# EAGLE design vga-switch (EAGLE 6.0)
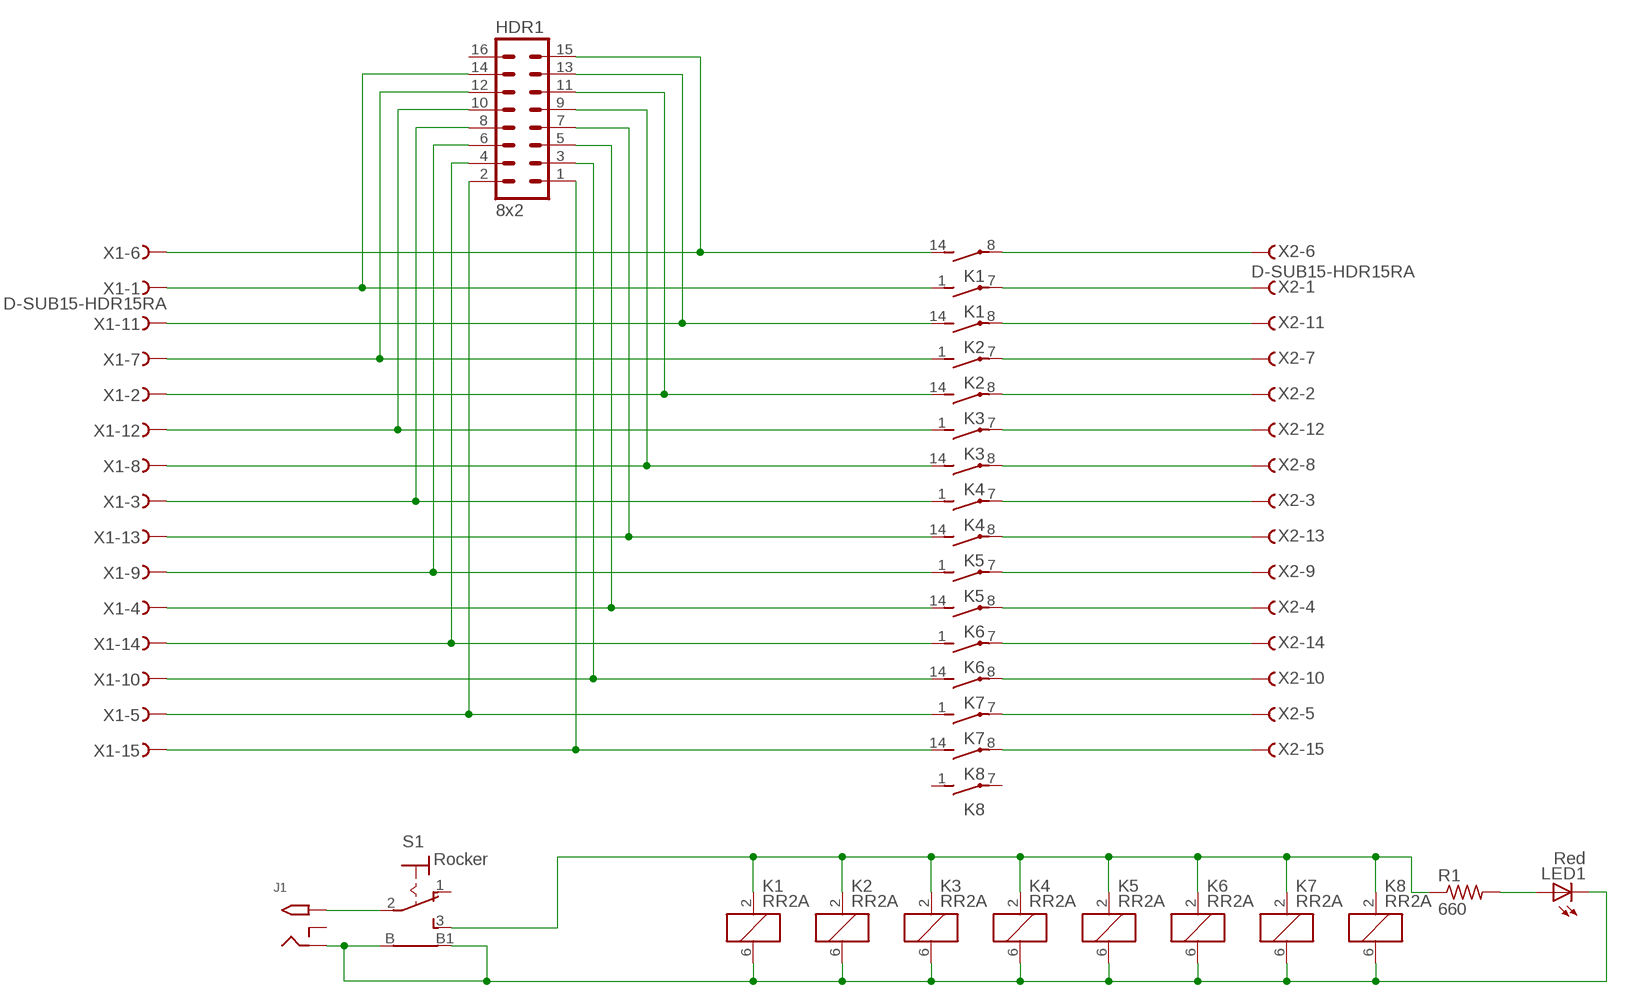
[diagram p0: schematic, sheet 1]

## Parts
HDR1  8x2  MA08-2  [MA08-2]
J1  2.1MMJACKTHM  [PJ-102A]
K1  RR2A  [RR2A]
K2  RR2A  [RR2A]
K3  RR2A  [RR2A]
K4  RR2A  [RR2A]
K5  RR2A  [RR2A]
K6  RR2A  [RR2A]
K7  RR2A  [RR2A]
K8  RR2A  [RR2A]
LED1  Red  LED5MM  [LED5MM]
R1  660  R-US_0207/10  [0207/10]
S1  Rocker  ROCKERSWITCH  [ROCKERSWITCH]
X1  D-SUB15-HDR15RA  [HDR15RA]
X2  D-SUB15-HDR15RA  [HDR15RA]

## Nets
N$1: J1.TIP S1.2(P)
N$2: J1.RING K1.6 K2.6 K3.6 K4.6 K5.6 K6.6 K7.6 K8.6 LED1.K(C) S1.B S1.B1
N$3: HDR1.15 K1.14(3:S) X1.6
N$4: K1.2 K2.2 K3.2 K4.2 K5.2 K6.2 K7.2 K8.2 R1.1 S1.3(S)
N$5: LED1.A R1.2
N$6: HDR1.14 K1.1(2:S) X1.1
N$7: HDR1.13 K2.14(3:S) X1.11
N$8: HDR1.12 K2.1(2:S) X1.7
N$9: HDR1.11 K3.14(3:S) X1.2
N$10: HDR1.10 K3.1(2:S) X1.12
N$11: HDR1.9 K4.14(3:S) X1.8
N$12: HDR1.8 K4.1(2:S) X1.3
N$13: HDR1.7 K5.14(3:S) X1.13
N$14: HDR1.6 K5.1(2:S) X1.9
N$15: HDR1.5 K6.14(3:S) X1.4
N$16: HDR1.4 K6.1(2:S) X1.14
N$17: HDR1.3 K7.14(3:S) X1.10
N$18: HDR1.2 K7.1(2:S) X1.5
N$19: HDR1.1 K8.14(3:S) X1.15
N$33: K1.8(3:P) X2.6
N$34: K1.7(2:P) X2.1
N$35: K2.8(3:P) X2.11
N$36: K2.7(2:P) X2.7
N$37: K3.8(3:P) X2.2
N$38: K3.7(2:P) X2.12
N$39: K4.8(3:P) X2.8
N$40: K4.7(2:P) X2.3
N$41: K5.8(3:P) X2.13
N$42: K5.7(2:P) X2.9
N$43: K6.8(3:P) X2.4
N$44: K6.7(2:P) X2.14
N$45: K7.8(3:P) X2.10
N$46: K7.7(2:P) X2.5
N$47: K8.8(3:P) X2.15
Unconnected: HDR1.16 J1.RING_SW K8.1(2:S) K8.7(2:P) S1.1(O)

## Library data of the parts
HDR1 = con-lstb:MA08-2: PIN HEADER; OC_FARNELL: unknown; OC_NEWARK: unknown
J1 = adafruit:2.1MMJACK: 2.1mm x 5.5mm THM DC jack with internal switch. Digikey part #PJ-102A, 4UCON part #05537 2.1mm x 5.5mm SMT DC jack with internal switch. Digikey part #PJ-002A-SMT, 4UCON part #03267 By microbuilder.eu & adafruit.com
K1-K8 = relay:RR2A: RELAY reed, polarity, 2 x norm. open; OC_FARNELL: unknown; OC_NEWARK: unknown
LED1 = led:LED: LED OSRAM: - CHIPLED LG R971, LG N971, LY N971, LG Q971, LY Q971, LO R971, LY R971 LH N974, LH R974 LS Q976, LO Q976, LY Q976 LO Q996 - Hyper CHIPLED LW Q18S LB Q993, LB Q99A, LB R99A - SideLED LS A670, LO A670, LY A670, LG A670, LP A670 LB A673, LV A673, LT A673, LW A673 LH A674 LY A675 LS A676, LA A676, LO A676, LY A676, LW A676 LS A679, LY A679, LG A679 - Hyper Micro SIDELED® LS Y876, LA Y876, LO Y876, LY Y876 LT Y87S - SmartLED LW L88C, LW L88S LB L89C, LB L89S, LG L890 LS L89K, LO L89K, LY L89K LS L896, LA L896, LO L896, LY L896 - TOPLED LS T670, LO T670, LY T670, LG T670, LP T670 LSG T670, LSP T670, LSY T670, LOP T670, LYG T670 LG T671, LOG T671, LSG T671 LB T673, LV T673, LT T673, LW T673 LH T674 LS T676, LA T676, LO T676, LY T676, LB T676, LH T676, LSB T676, LW T676 LB T67C, LV T67C, LT T67C, LS T67K, LO T67K, LY T67K, LW E67C LS E67B, LA E67B, LO E67B, LY E67B, LB E67C, LV E67C, LT E67C LW T67C LS T679, LY T679, LG T679 LS T770, LO T770, LY T770, LG T770, LP T770 LB T773, LV T773, LT T773, LW T773 LH T774 LS E675, LA E675, LY E675, LS T675 LS T776, LA T776, LO T776, LY T776, LB T776 LHGB T686 LT T68C, LB T68C - Hyper Mini TOPLED® LB M676 - Mini TOPLED Santana® LG M470 LS M47K, LO M47K, LY M47K Source: http://www.osram.convergy.de LUXEON: - LUMILED® LXK2-PW12-R00, LXK2-PW12-S00, LXK2-PW14-U00, LXK2-PW14-V00 LXK2-PM12-R00, LXK2-PM12-S00, LXK2-PM14-U00 LXK2-PE12-Q00, LXK2-PE12-R00, LXK2-PE12-S00, LXK2-PE14-T00, LXK2-PE14-U00 LXK2-PB12-K00, LXK2-PB12-L00, LXK2-PB12-M00, LXK2-PB14-N00, LXK2-PB14-P00, LXK2-PB14-Q00 LXK2-PR12-L00, LXK2-PR12-M00, LXK2-PR14-Q00, LXK2-PR14-R00 LXK2-PD12-Q00, LXK2-PD12-R00, LXK2-PD12-S00 LXK2-PH12-R00, LXK2-PH12-S00 LXK2-PL12-P00, LXK2-PL12-Q00, LXK2-PL12-R00 Source: www.luxeon.com KINGBRIGHT: KA-3528ASYC Source: www.kingbright.com
R1 = resistor:R-US_: RESISTOR, American symbol
S1 = antitronics:ROCKERSWITCH: Rocker Switch C&K ET01J6ABE2
X1 X2 = con-thomas-betts:D-SUB15-: D-Subminiatur Connector Source: Electronioc Interconnects European Edition 1998; OC_FARNELL: unknown; OC_NEWARK: unknown

## Board
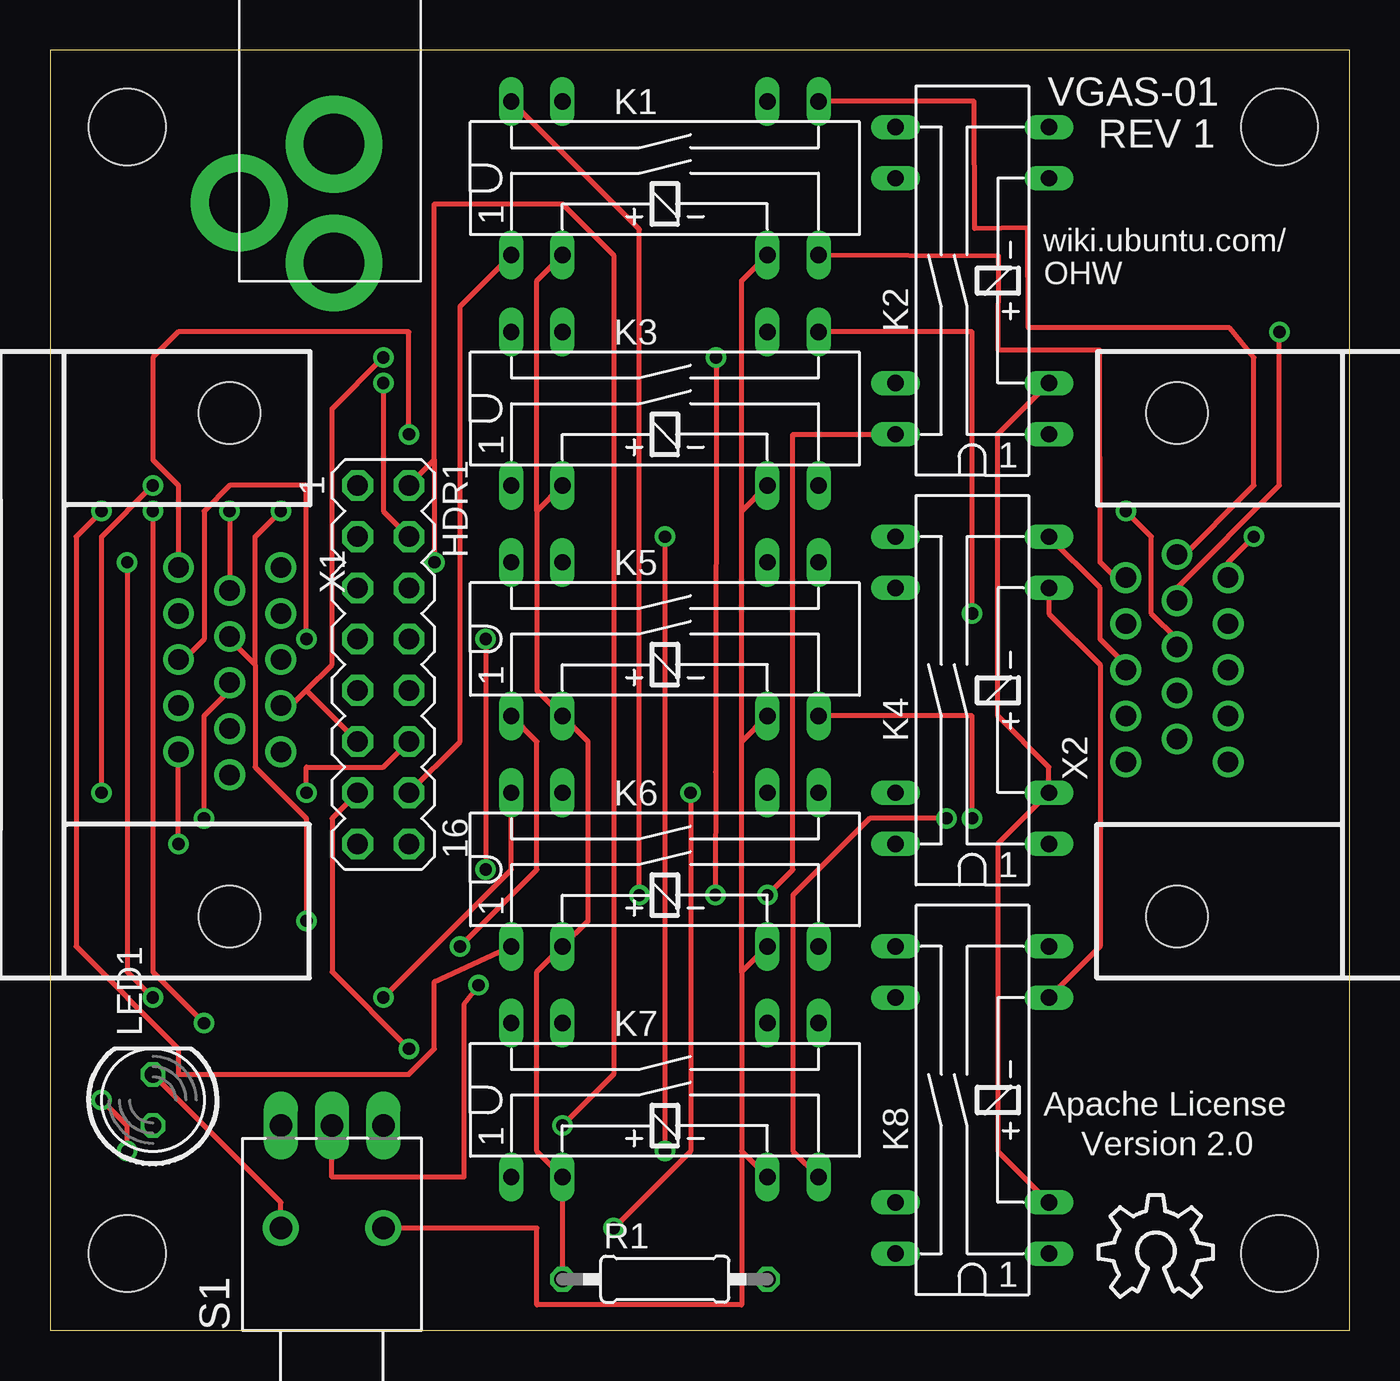
[diagram p1: board, top side]
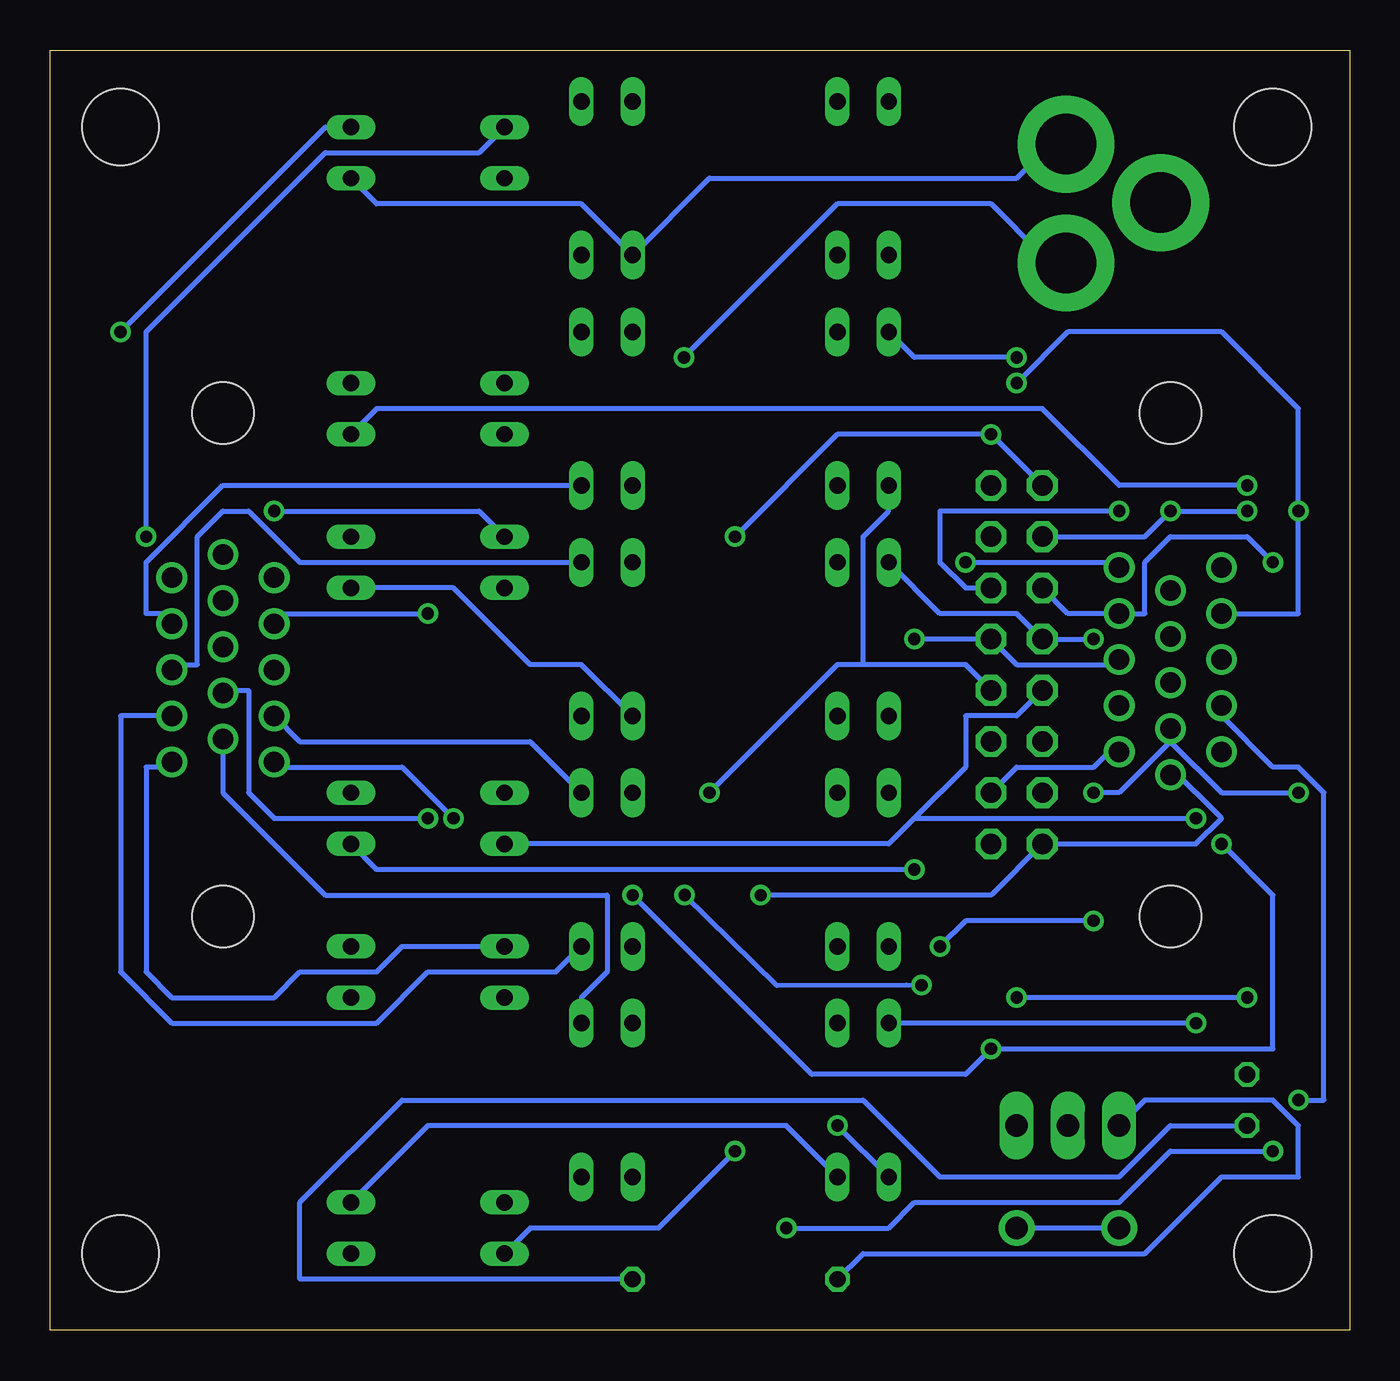
[diagram p2: board, bottom side, seen from below]

Size 64.44 x 63.49 mm. Coordinates in mm from the lower left corner, seen from the top.
Outline: 0,0 64.44,0 64.44,63.49 0,63.49 0,0
Copper layers (1*16): Top 0.0178mm / dielectric 59mil / Bottom 0.0178mm
Design rules: minimum track width 6mil, minimum drill 14mil, track to track 6mil, track to pad 6mil, pad to pad 6mil, via to via 6mil, smd to smd 6mil, copper to edge 20mil, drill to drill 16mil, minimum pad ring 8mil, minimum via ring 8mil, stop-mask expansion 3mil, vias tented up to drill 0mil, thermal gap 10mil
Holes 3.8 mm at 3.81,3.81 3.81,59.69 60.96,59.69 60.96,3.81
tRestrict: area 0,57.2 to 6.3,63.5; area 6.4,43.2 to 11.4,48.3; area 6.4,17.8 to 11.4,22.9; area 0,0 to 6.3,6.3; area 58.4,0 to 64.8,6.3; area 53.3,17.8 to 58.4,22.9; area 53.3,43.2 to 58.4,48.3; area 58.4,57.2 to 64.8,63.5; area 9.5,0 to 18.4,4
bRestrict: area 58.4,57.2 to 64.8,63.5; area 53.3,43.2 to 58.4,48.3; area 53.3,17.8 to 58.4,22.9; area 58.4,0 to 64.8,6.3; area 0,0 to 6.3,6.3; area 6.4,17.8 to 11.4,22.9; area 6.4,43.2 to 11.4,48.3; area 0,57.2 to 6.3,63.5

### Footprints (pad centres in the part's own frame; a part is rotated, then mirrored left to right if it is on the bottom)
MA08-2 = drill 1.016 octagon: 1 -8.89,-1.27; 2 -8.89,1.27; 3 -6.35,-1.27; 4 -6.35,1.27; 5 -3.81,-1.27; 6 -3.81,1.27; 7 -1.27,-1.27; 8 -1.27,1.27; 9 1.27,-1.27; 10 1.27,1.27; 11 3.81,-1.27; 12 3.81,1.27; 13 6.35,-1.27; 14 6.35,1.27; 15 8.89,-1.27; 16 8.89,1.27
PJ-102A = drill 3 pad 4.8: RING 0.1,-3.39; RING_SW -4.6,-6.29; TIP 0.1,-9.29
RR2A = drill 0.813 long: 1 -7.62,-3.81; 2 -5.08,-3.81; 6 5.08,-3.81; 7 7.62,-3.81; 8 7.62,3.81; 9 5.08,3.81; 13 -5.08,3.81; 14 -7.62,3.81
LED5MM = drill 0.813 octagon: A -1.27,0; K 1.27,0
0207/10 = drill 0.813 octagon: 1 -5.08,0; 2 5.08,0
ROCKERSWITCH = drill 1.118 long: 1 5.08,-2.54; 2 5.08,0; 3 5.08,2.54 | drill 1.118 pad 1.778: B 0,-2.54; B1 0,2.54
HDR15RA = drill 1.016: 1 4.318,2.54; 2 2.032,2.54; 3 -0.254,2.54; 4 -2.54,2.54; 5 -4.826,2.54; 6 5.461,0; 7 3.175,0; 8 0.889,0; 9 -1.397,0; 10 -3.683,0; 11 4.318,-2.54; 12 2.032,-2.54; 13 -0.254,-2.54; 14 -2.54,-2.54; 15 -4.826,-2.54 | hole 3.048: -12.497,0; 12.497,0

### Placement (x,y rotation side)
HDR1  16.51,33.02 270 top
J1  13.97,62.23 0 top
K1  30.48,57.15 0 top
K2  45.72,52.07 90 top
K3  30.48,45.72 0 top
K4  45.72,31.75 90 top
K5  30.48,34.29 0 top
K6  30.48,22.86 0 top
K7  30.48,11.43 0 top
K8  45.72,11.43 90 top
LED1  5.08,11.43 90 top
R1  30.48,2.54 0 top
S1  13.97,5.08 90 top
U$1  [OSHW_8X200_NOTEXT]  51.99,1.65 0 top
U$2  [UBUNTU-LOGO]  50.55,12.68 0 top
X1  8.89,33.02 270 top
X2  55.88,33.02 90 top

### Tracks (layer width: path | path; a pad name or v marks a point on that pad's centre or on a via)
N$1  (via drill 0.61)
  Top 0.254: S1.2 13.97,7.6 20.51,7.6 20.51,16.17 v21.23,17.12 | v32.98,21.59 32.99,27.7 v33.02,48.26
  Bottom 0.254: v21.23,17.12 21.98,17.14 28.41,17.11 v32.98,21.59 | v33.02,48.26 25.4,55.88 17.78,55.88 15.24,53.34 J1.TIP
N$2
  Top 0.254: K8.6 52.07,19.05 52.07,33.02 49.53,35.56 K4.6 | LED1.K 11.43,6.35 S1.B1 | 34.29,8.89 K7.6 | 34.29,17.78 34.29,8.89 | K6.6 34.29,17.78 | 34.29,29.21 K5.6 | 34.29,17.78 34.29,29.21 | 34.29,40.64 K3.6 | 34.29,29.21 34.29,40.64 | K1.6 34.29,52.07 34.29,40.64 | S1.B 24.13,5.08 24.13,1.27 34.29,1.27 34.29,8.89
  Bottom 0.254: S1.B1 S1.B | K2.6 48.26,55.88 38.1,55.88 K1.6 31.75,57.15 16.51,57.15 15.24,58.42 J1.RING | K4.6 44.45,36.83 40.64,33.02 38.1,33.02 K5.6
N$3  (via drill 0.61)
  Top 0.254: K1.14 29.21,54.61 v29.21,21.59
  Bottom 0.254: v29.21,21.59 17.78,21.59 HDR1.15 7.62,24.13 6.35,25.4 8.89,27.94 X1.6
N$4
  Top 0.254: K8.2 46.99,8.89 46.99,24.13 K4.2 49.53,27.94 46.99,30.48 46.99,44.45 K2.2 | 24.13,40.64 24.13,31.75 K5.2 26.67,29.21 26.67,20.32 K6.2 24.13,17.78 24.13,8.89 K7.2 R1.1 | K3.2 24.13,40.64 | K1.2 24.13,52.07 24.13,40.64
  Bottom 0.254: S1.3 10.16,11.43 3.81,11.43 2.54,10.16 2.54,7.62 6.35,7.62 10.16,3.81 24.13,3.81 R1.1 | K8.2 45.72,10.16 27.94,10.16 K7.2
N$5
  Bottom 0.254: LED1.A 8.89,10.16 11.43,7.62 20.32,7.62 24.13,11.43 46.99,11.43 52.07,6.35 52.07,2.54 R1.2
N$6
  Top 0.254: K1.1 20.32,50.8 20.32,29.21 HDR1.14
  Bottom 0.254: HDR1.14 16.51,27.94 12.7,27.94 11.43,29.21 X1.1
N$7  (via drill 0.61)
  Top 0.254: K2.14 36.83,44.45 36.83,22.86 v35.56,21.59 | v17.78,13.97 13.97,17.78 13.97,25.4 HDR1.13 | v6.35,24.13 X1.11 6.35,29.21
  Bottom 0.254: v35.56,21.59 26.67,12.7 19.05,12.7 v17.78,13.97 3.81,13.97 3.81,21.59 v6.35,24.13
N$8  (via drill 0.61)
  Top 0.254: v5.08,41.91 2.54,39.37 v2.54,26.67 | HDR1.12 16.51,27.94 12.7,27.94 v12.7,26.67
  Bottom 0.254: K2.1 48.26,45.72 15.24,45.72 11.43,41.91 v5.08,41.91 | v2.54,26.67 6.35,26.67 8.89,29.21 | v12.7,26.67 11.43,26.67 8.89,29.21 | 8.89,29.21 X1.7
N$9  (via drill 0.61)
  Top 0.254: v16.51,48.26 13.97,45.72 13.97,33.02 12.7,31.75 | 12.7,31.75 11.43,30.48 X1.2 | 12.7,31.75 HDR1.11
  Bottom 0.254: K3.14 21.59,48.26 v16.51,48.26
N$10  (via drill 0.61)
  Top 0.254: v2.54,11.43 3.81,10.16 v3.81,8.89 | v27.94,5.08 31.75,8.89 v31.75,26.67
  Bottom 0.254: K3.1 22.86,40.64 24.13,39.37 24.13,33.02 | 24.13,33.02 19.05,33.02 HDR1.10 | v2.54,11.43 1.27,11.43 1.27,26.67 2.54,27.94 3.81,27.94 6.35,30.48 X1.12 | v3.81,8.89 8.89,8.89 11.43,6.35 21.59,6.35 22.86,5.08 v27.94,5.08 | v31.75,26.67 25.4,33.02 24.13,33.02
N$11  (via drill 0.61)
  Top 0.254: v7.62,25.4 7.62,30.48 8.89,31.75 X1.8
  Bottom 0.254: K4.14 22.86,24.13 21.59,25.4 | 21.59,25.4 19.05,27.94 19.05,30.48 16.51,30.48 HDR1.9 | 21.59,25.4 v7.62,25.4
N$12  (via drill 0.61)
  Top 0.254: v21.59,34.29 v21.59,22.86
  Bottom 0.254: K4.1 48.26,22.86 v21.59,22.86 | v21.59,34.29 HDR1.8 16.51,33.02 11.43,33.02 X1.3
N$13  (via drill 0.61)
  Top 0.254: v12.7,34.29 12.7,41.91 8.89,41.91 7.62,40.64 7.62,34.29 6.35,33.02 X1.13
  Bottom 0.254: K5.14 20.32,35.56 16.51,35.56 HDR1.7 v12.7,34.29
N$14  (via drill 0.61)
  Top 0.254: K5.1 24.13,29.21 24.13,22.86 v20.32,19.05 | v12.7,20.32 12.7,25.4 10.16,27.94 10.16,33.02 | 10.16,33.02 8.89,34.29 X1.9 | v11.43,40.64 10.16,39.37 10.16,33.02
  Bottom 0.254: v20.32,19.05 19.05,20.32 v12.7,20.32 | HDR1.6 19.05,36.83 20.32,38.1 20.32,40.64 v11.43,40.64
N$15  (via drill 0.61)
  Top 0.254: K6.14 22.86,22.86 v16.51,16.51 | v5.08,16.51 3.81,17.78 v3.81,38.1
  Bottom 0.254: v5.08,16.51 v16.51,16.51 | v3.81,38.1 5.08,39.37 8.89,39.37 10.16,38.1 10.16,35.56 X1.4 13.97,35.56 HDR1.5
N$16  (via drill 0.61)
  Top 0.254: K6.1 19.05,17.3 19.05,13.97 17.78,12.7 6.35,12.7 6.35,13.97 1.27,19.05 1.27,39.37 v2.54,40.64 | HDR1.4 16.51,40.64 v16.51,46.99
  Bottom 0.254: X1.14 2.54,35.56 v2.54,40.64 2.54,45.72 6.35,49.53 13.97,49.53 v16.51,46.99
N$17  (via drill 0.61)
  Top 0.254: v7.62,15.24 5.08,17.78 v5.08,40.64 | v8.89,40.64 X1.10
  Bottom 0.254: v7.62,15.24 K7.14 | v5.08,40.64 v8.89,40.64 10.16,39.37 HDR1.3
N$18  (via drill 0.61)
  Top 0.254: v25.4,10.16 27.94,12.7 27.94,53.34 25.4,55.88 19.05,55.88 19.05,43.18 | HDR1.2 19.05,43.18 | 19.05,43.18 v19.05,38.1
  Bottom 0.254: v25.4,10.16 K7.1 | v19.05,38.1 11.43,38.1 X1.5
N$19  (via drill 0.61)
  Top 0.254: v30.48,39.37 v30.48,8.89 | X1.15 6.35,41.91 5.08,43.18 5.08,48.26 6.35,49.53 17.78,49.53 v17.78,44.45
  Bottom 0.254: K8.14 40.64,5.08 34.29,5.08 v30.48,8.89 | v30.48,39.37 25.4,44.45 v17.78,44.45 HDR1.1
N$33
  Top 0.254: K1.8 45.81,60.96 45.85,54.65 48.47,54.69 48.51,49.73 58.49,49.73 59.69,48.26 59.69,41.91 55.88,38.1 X2.6
N$34
  Top 0.254: K1.7 47.04,53.29 47,48.62 52.04,48.62 52.07,38.1 53.34,36.83 X2.1
N$35  (via drill 0.61)
  Top 0.254: v59.69,39.37 58.42,38.1 X2.11 58.42,36.83
  Bottom 0.254: K2.8 43.18,58.42 50.8,58.42 59.69,49.53 v59.69,39.37
N$36  (via drill 0.61)
  Top 0.254: v60.96,49.53 60.96,41.91 55.88,36.83 X2.7
  Bottom 0.254: K2.7 50.8,59.69 v60.96,49.53
N$37  (via drill 0.61)
  Top 0.254: K3.8 45.72,49.53 v45.72,35.56
  Bottom 0.254: v45.72,35.56 53.34,35.56 X2.2
N$38
  Bottom 0.254: K3.7 55.88,41.91 59.69,38.1 59.69,35.56 58.42,35.56 X2.12
N$39  (via drill 0.61)
  Top 0.254: v53.34,40.64 54.61,39.37 54.61,35.56 55.88,34.29 X2.8
  Bottom 0.254: K4.8 43.18,40.64 v53.34,40.64
N$40
  Top 0.254: K4.7 52.07,36.83 52.07,34.29 53.34,33.02 X2.3
N$41
  Bottom 0.254: K5.8 52.07,38.1 54.61,40.64 55.88,40.64 57.15,39.37 57.15,33.02 58.42,33.02 X2.13
N$42  (via drill 0.61)
  Top 0.254: K5.7 45.72,30.48 v45.72,25.4
  Bottom 0.254: v45.72,25.4 53.34,25.4 54.61,26.67 54.61,31.75 55.88,31.75 X2.9
N$43
  Bottom 0.254: K6.8 40.64,29.21 52.07,29.21 X2.4
N$44
  Bottom 0.254: K6.7 39.37,17.78 45.72,17.78 48.26,15.24 58.42,15.24 60.96,17.78 60.96,30.48 X2.14
N$45
  Bottom 0.254: K7.8 38.1,16.51 36.83,17.78 36.83,21.59 50.8,21.59 55.88,26.67 X2.10
N$46  (via drill 0.61)
  Top 0.254: K7.7 36.83,8.89 36.83,21.59 40.64,25.4 v44.45,25.4
  Bottom 0.254: v44.45,25.4 46.99,27.94 53.34,27.94 X2.5
N$47
  Bottom 0.254: K8.8 46.99,19.05 48.26,17.78 52.07,17.78 53.34,16.51 58.42,16.51 59.69,17.78 59.69,27.94 58.42,27.94 X2.15

### Text on the board
tNames: Apache License | Version 2.0
_tsilk: VGAS-01 | REV 1 | wiki.ubuntu.com/ | OHW